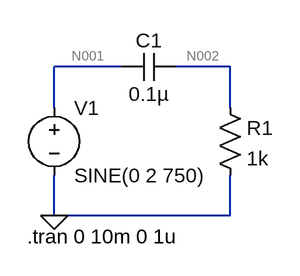
[diagram p0: schematic Draft6.asc]
Draft6.asc, the LTspice schematic file:
Version 4
SHEET 1 880 680
WIRE 80 80 0 80
WIRE 208 80 144 80
WIRE 0 128 0 80
WIRE 208 128 208 80
WIRE 0 256 0 208
WIRE 208 256 208 208
WIRE 208 256 0 256
FLAG 0 256 0
SYMBOL voltage 0 112 R0
WINDOW 123 0 0 Left 0
WINDOW 39 0 0 Left 0
SYMATTR InstName V1
SYMATTR Value SINE(0 2 750)
SYMBOL res 192 112 R0
SYMATTR InstName R1
SYMATTR Value 1k
SYMBOL cap 144 64 R90
WINDOW 0 0 32 VBottom 2
WINDOW 3 32 32 VTop 2
SYMATTR InstName C1
SYMATTR Value 0.1µ
TEXT -32 280 Left 2 !.tran 0 10m 0 1u

The netlist it stands for:
* Draft6.asc
V1 N001 0 SINE(0 2 750)
R1 N002 0 1k
C1 N002 N001 0.1µ
.tran 0 10m 0 1u
.backanno
.end

* Results of the author's LTspice run, read from the files saved beside the schematic
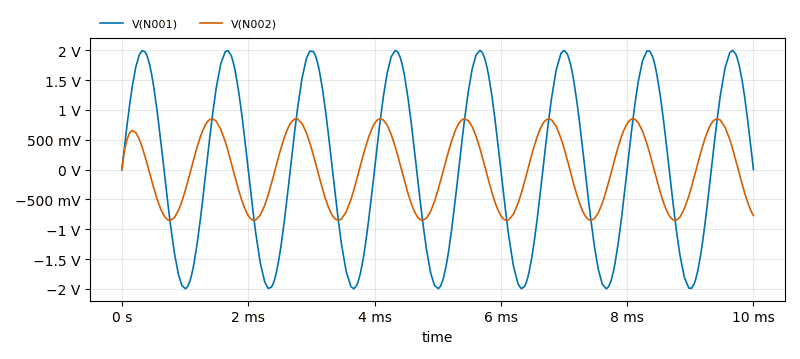
[diagram p1: Transient Analysis of Draft6.asc, plotted from the saved traces]
* Transient Analysis, 1 run:
*   V(N001): min -2 V, max 2 V, average 84.5 mV, rms 1.413 V, last 0 V
*   V(N002): min -852.7 mV, max 852.5 mV, average 7.557 mV, rms 594.6 mV, last -771.2 mV